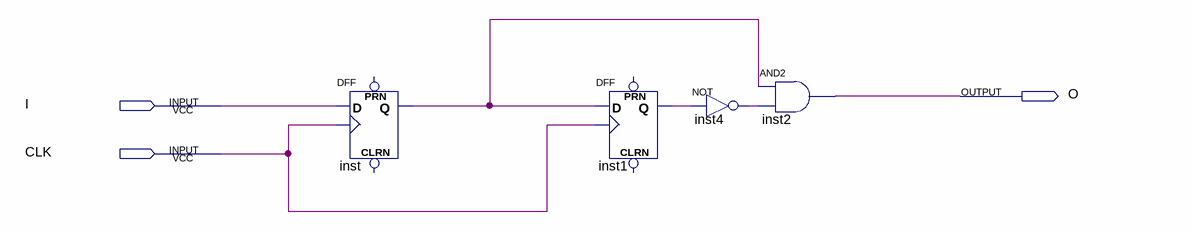
[diagram p0: schematic sheet]
// Quartus schematic RisingEgde.bdf as structural Verilog: 4 symbols, 3 pins
module RisingEgde (
  input  I,
  input  CLK,
  output O
);

  wire inst1_q, inst4_out, inst_q;

  DFF inst (.CLK(CLK), .D(I), .Q(inst_q));  // open: CLRN, PRN
  DFF inst1 (.CLK(CLK), .D(inst_q), .Q(inst1_q));  // open: CLRN, PRN
  not inst4 (inst4_out, inst1_q);
  and inst2 (O, inst_q, inst4_out);
endmodule
